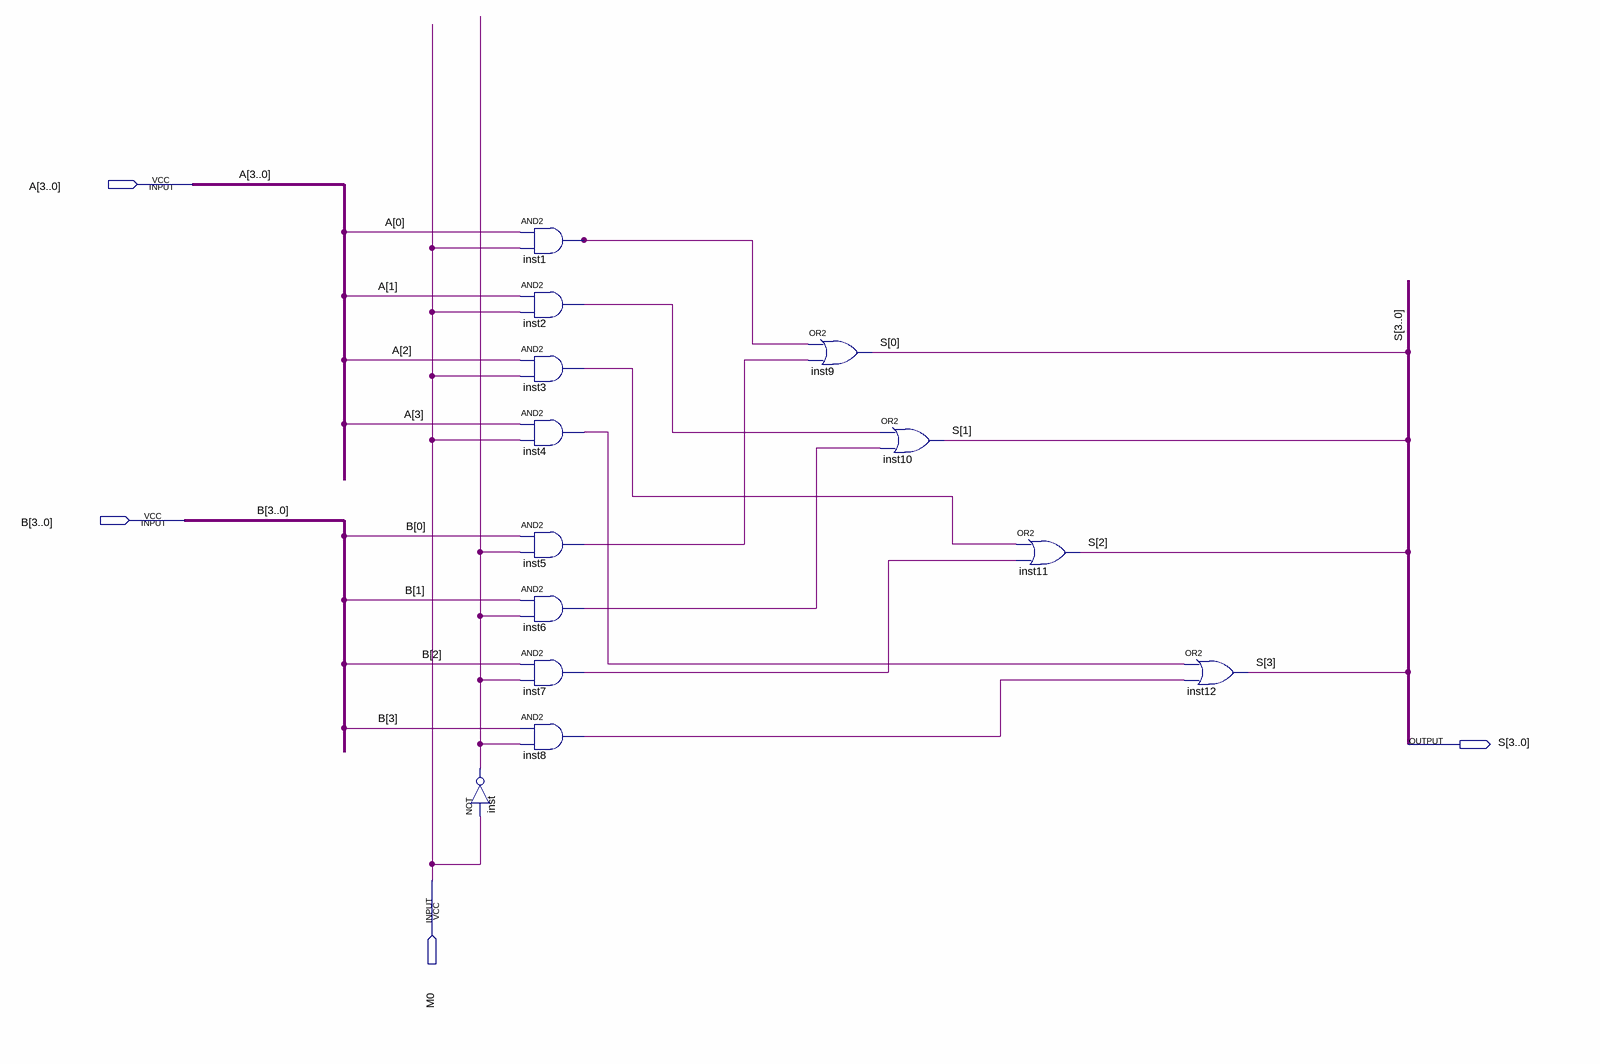
[diagram p0: schematic sheet]
// Quartus schematic mux21.bdf as structural Verilog: 13 symbols, 4 pins
module mux21 (
  input  [3:0] A,
  input  [3:0] B,
  input  M0,
  output [3:0] S
);

  wire inst1_out, inst2_out, inst3_out, inst4_out, inst5_out, inst6_out, inst7_out, inst8_out, inst_out;

  and inst1 (inst1_out, A[0], M0);
  and inst2 (inst2_out, A[1], M0);
  and inst3 (inst3_out, A[2], M0);
  and inst4 (inst4_out, A[3], M0);
  and inst5 (inst5_out, B[0], inst_out);
  and inst6 (inst6_out, B[1], inst_out);
  and inst7 (inst7_out, B[2], inst_out);
  and inst8 (inst8_out, B[3], inst_out);
  not inst (inst_out, M0);
  or inst9 (S[0], inst1_out, inst5_out);
  or inst10 (S[1], inst2_out, inst6_out);
  or inst11 (S[2], inst3_out, inst7_out);
  or inst12 (S[3], inst4_out, inst8_out);
endmodule
